# EAGLE design EthernetGCS (EAGLE 6.1)
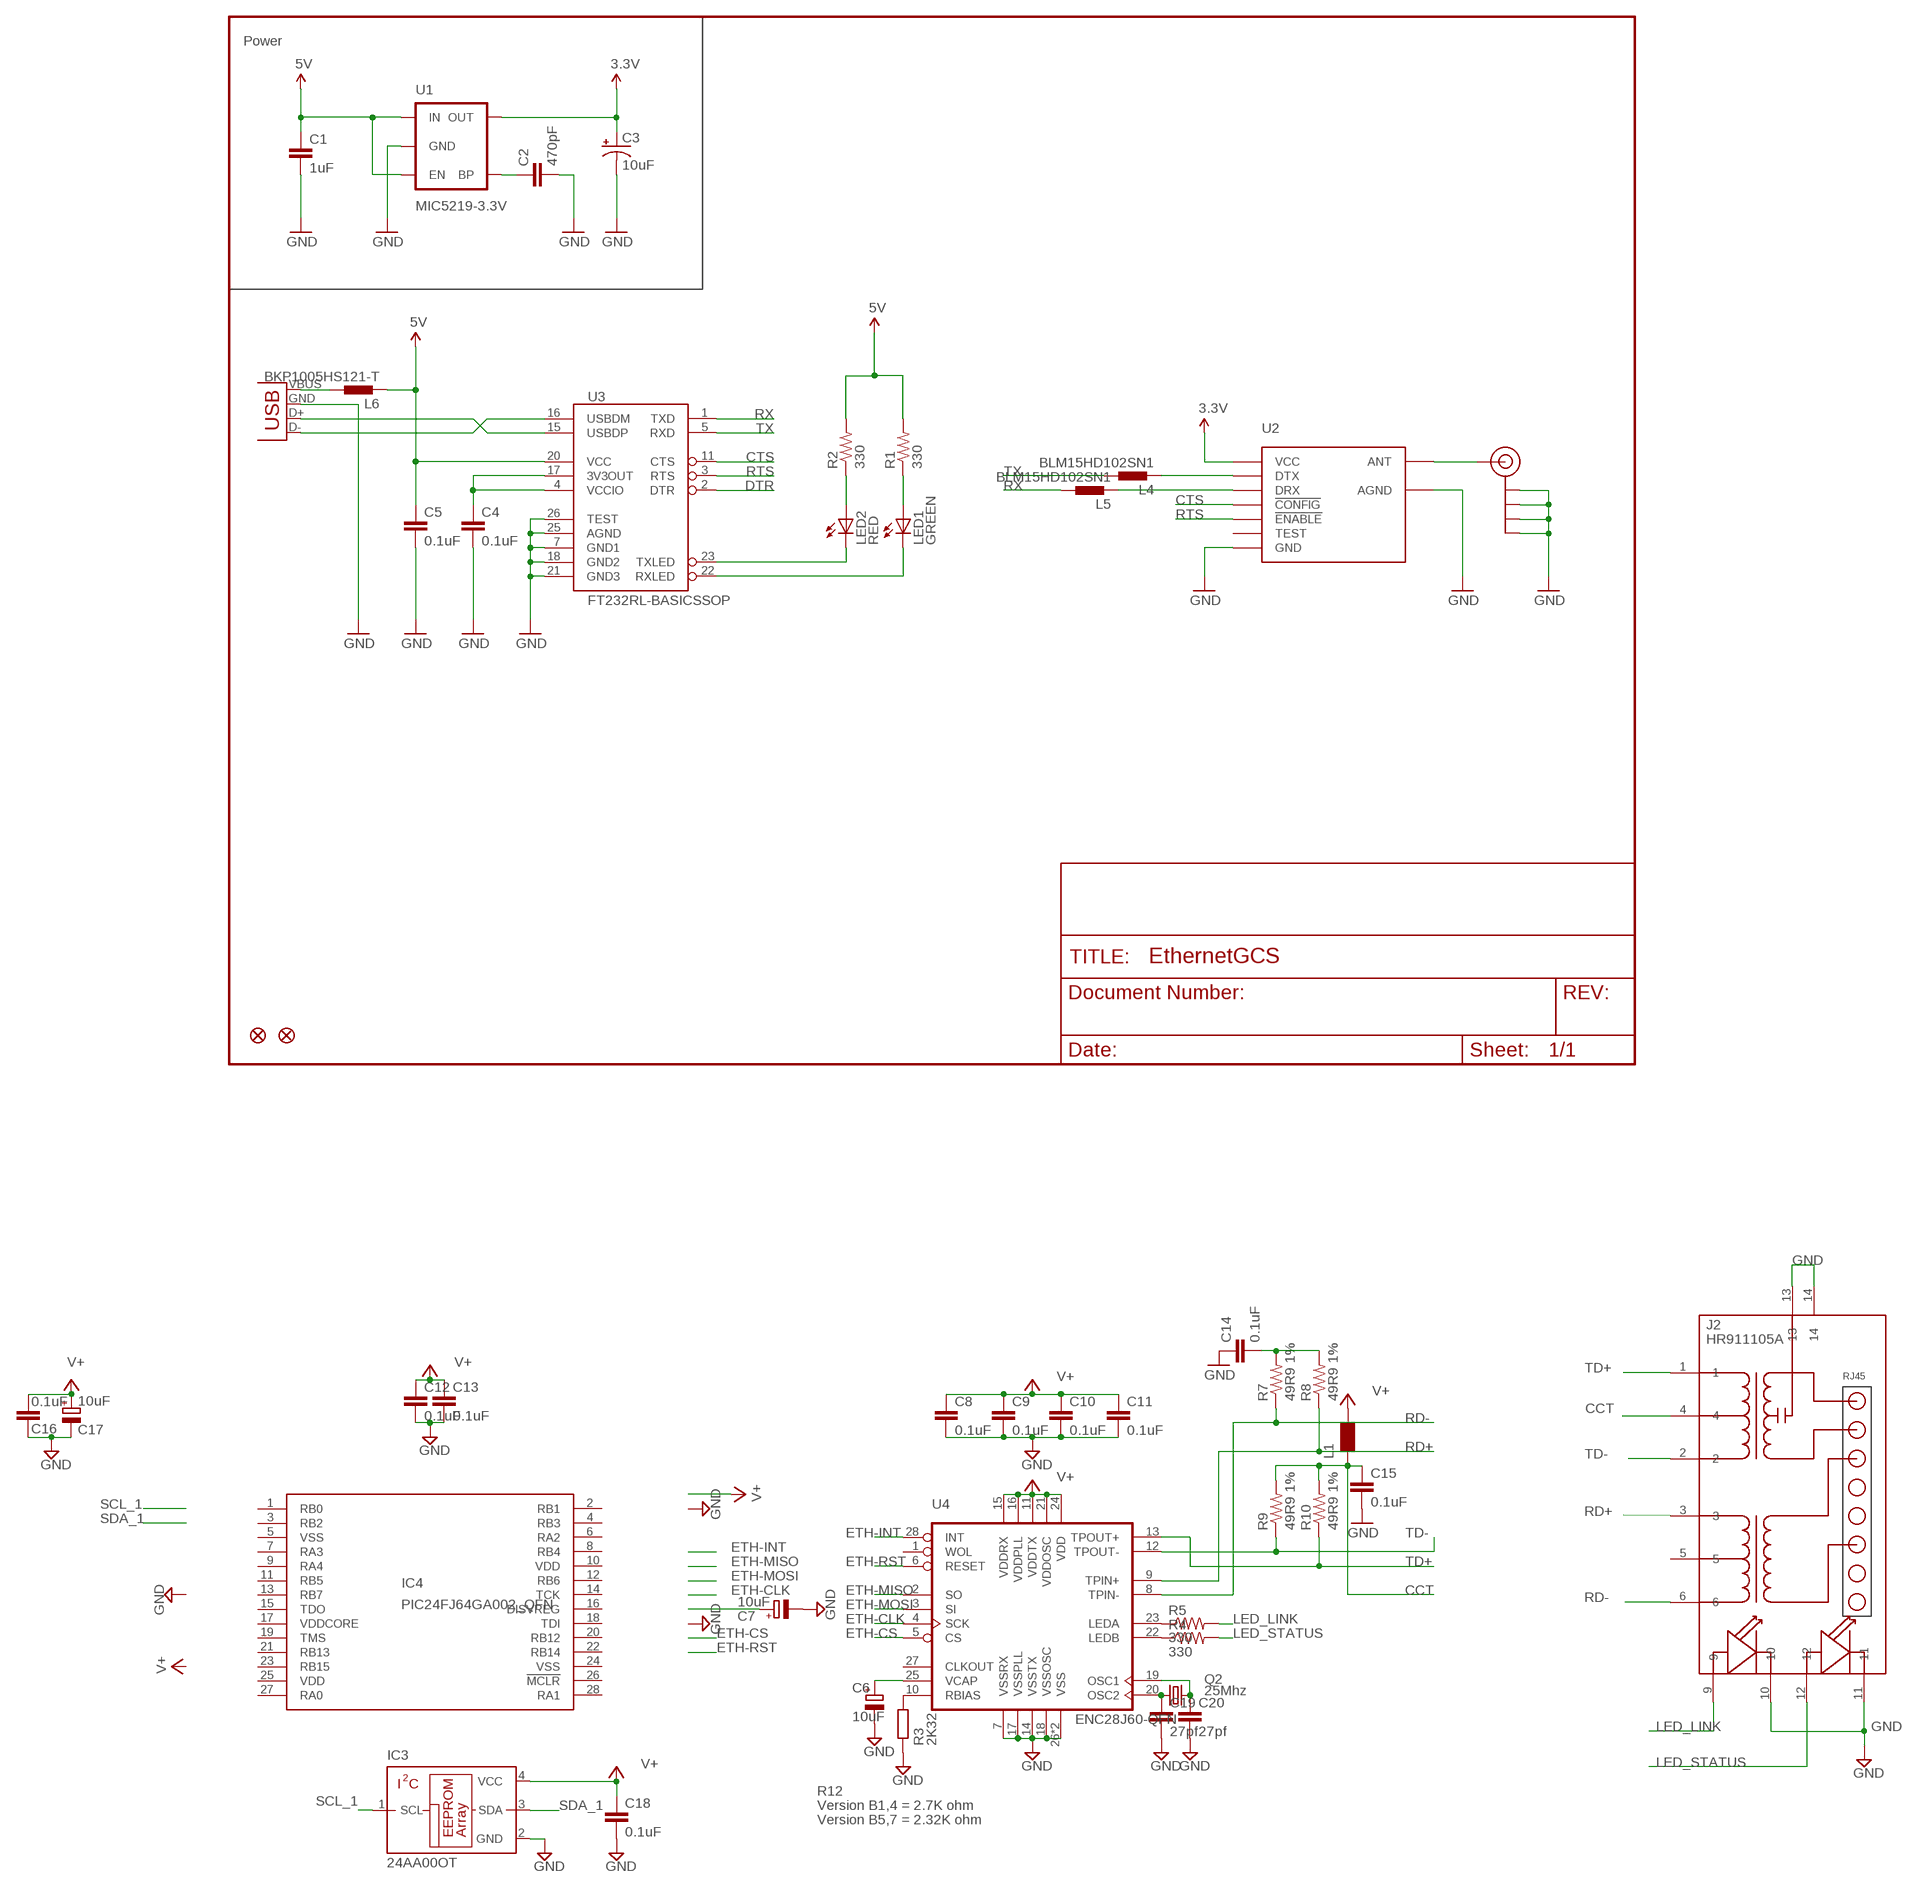
[diagram p0: schematic, sheet 1]

## Parts
C1  1uF  CAP0402-CAP  [0402-CAP]
C2  470pF  CAP0402-CAP  [0402-CAP]
C3  10uF  CAP_POL1206  [EIA3216]
C4  0.1uF  CAP0402-CAP  [0402-CAP]
C5  0.1uF  CAP0402-CAP  [0402-CAP]
C6  10uF  CPOL-EUSMCA  [SMC_A]
C7  10uF  CPOL-EUSMCA  [SMC_A]
C8  0.1uF  CAP0402-CAP  [0402-CAP]
C9  0.1uF  CAP0402-CAP  [0402-CAP]
C10  0.1uF  CAP0402-CAP  [0402-CAP]
C11  0.1uF  CAP0402-CAP  [0402-CAP]
C12  0.1uF  CAP0402-CAP  [0402-CAP]
C13  0.1uF  CAP0402-CAP  [0402-CAP]
C14  0.1uF  CAP0402-CAP  [0402-CAP]
C15  0.1uF  CAP0402-CAP  [0402-CAP]
C16  0.1uF  C-EUC0805  [C0805]
C17  10uF  CPOL-EUSMCA  [SMC_A]
C18  0.1uF  CAP0402-CAP  [0402-CAP]
C19  27pf  CAP0402-CAP  [0402-CAP]
C20  27pf  CAP0402-CAP  [0402-CAP]
IC3  24AA00OT  [SOT23-5L]
IC4  PIC24FJ64GA002_QFN  [QFN28-ML_6X6MM]
J2  HR911105A  [HR911105A]
J$1  SMA_EDGE  [SMA-EDGE]
JP1  FIDUCIAL1X2  [FIDUCIAL-1X2]
JP2  FIDUCIAL1X2  [FIDUCIAL-1X2]
L1  WE-KIL_0805  [WE-KI_0805_B]
L4  BLM15HD102SN1  INDUCTOR-0402  [0402-IND]
L5  BLM15HD102SN1  INDUCTOR-0402  [0402-IND]
L6  BKP1005HS121-T  INDUCTOR-0402  [0402-IND]
LED1  GREEN  LED0603  [LED-0603]
LED2  RED  LED0603  [LED-0603]
Q2  25Mhz  CRYSTALCTS406  [CTS406]
R1  330  RESISTOR0402-RES  [0402-RES]
R2  330  RESISTOR0402-RES  [0402-RES]
R3  2K32  R-EU_R0805  [R0805]
R4  330  RESISTOR0402-RES  [0402-RES]
R5  330  RESISTOR0402-RES  [0402-RES]
R7  49R9 1%  RESISTOR0402-RES  [0402-RES]
R8  49R9 1%  RESISTOR0402-RES  [0402-RES]
R9  49R9 1%  RESISTOR0402-RES  [0402-RES]
R10  49R9 1%  RESISTOR0402-RES  [0402-RES]
U1  MIC5219-3.3V  V_REG_LDOSMD  [SOT23-5]
U2  HM-TRPSMD  [HM-TRP-SMD]
U3  FT232RL-BASICSSOP  [SSOP28DB]
U4  ENC28J60-QFN  [QFN28]
X1  USB-A-H  [USB-A-H]

## Nets
3.3V: C3.A(+) U1.5(OUT) U2.VCC
5V: C1.1 C5.1 L6.P$2 R1.2 R2.2 U1.1(IN) U1.3(EN) U3.20(VCC)
CCT: C15.1 J2.4 L1.2 R9.2 R10.2
CTS: U2.!CONFIG U3.11(CTS)
DTR: U3.2(DTR)
ETH-CLK: U4.4(SCK)
ETH-CS: U4.5(CS)
ETH-INT: U4.28(INT)
ETH-MISO: U4.2(SO)
ETH-MOSI: U4.3(SI)
ETH-RST: U4.6(RESET)
GND: C1.2 C2.2 C3.C(-) C4.2 C5.2 C6.- C7.- C8.2 C9.2 C10.2 C11.2 C12.2 C13.2 C14.1 C15.2 C16.2 C17.- C18.2 C19.2 C20.2 IC3.2(GND) J2.10 J2.11 J2.13 J2.14 J$1.GND@0(GND) J$1.GND@1(GND) J$1.GND@2(GND) J$1.GND@3(GND) R3.1 U1.2(GND) U2.AGND U2.GND U3.7(GND1) U3.18(GND2) U3.21(GND3) U3.25(AGND) U3.26(TEST) U4.7(VSSRX) U4.14(VSSTX) U4.17(VSSPLL) U4.18(VSSOSC) U4.26(VSS) U4.EXP(VSS) X1.GND(VBUS)
LED_LINK: J2.9 R5.2
LED_STATUS: J2.12 R4.2
N$1: J$1.SIG(SIGNAL) U2.ANT
N$2: C2.1 U1.4(BP)
N$3: C4.1 U3.4(VCCIO) U3.17(3V3OUT)
N$4: L4.P$2 U2.DTX
N$5: U3.15(USBDP) X1.D+(D-)
N$6: U3.16(USBDM) X1.D-(D+)
N$7: L5.P$2 U2.DRX
N$8: LED2.A R2.1
N$9: LED1.A R1.1
N$10: LED2.C U3.23(TXLED)
N$11: LED1.C U3.22(RXLED)
N$12: L6.P$1 X1.VBUS(GND)
N$13: C6.+ U4.25(VCAP)
N$14: C19.1 Q2.1 U4.20(OSC2)
N$15: C20.1 Q2.3 U4.19(OSC1)
N$16: C7.+
N$17: R3.2 U4.10(RBIAS)
N$18: R5.1 U4.23(LEDA)
N$19: R4.1 U4.22(LEDB)
N$22: C14.2 R7.2 R8.2
RD+: J2.3 R8.1 U4.9(TPIN+)
RD-: J2.6 R7.1 U4.8(TPIN-)
RTS: U2.!ENABLE U3.3(RTS)
RX: L5.P$1 U3.1(TXD)
SCL_1: IC3.1(SCL)
SDA_1: IC3.3(SDA)
TD+: J2.1 R10.1 U4.13(TPOUT+)
TD-: J2.2 R9.1 U4.12(TPOUT-)
TX: L4.P$1 U3.5(RXD)
V+: C8.1 C9.1 C10.1 C11.1 C12.1 C13.1 C16.1 C17.+ C18.1 IC3.4(VCC) L1.1 U4.11(VDDTX) U4.15(VDDRX) U4.16(VDDPLL) U4.21(VDDOSC) U4.24(VDD)
Unconnected: IC4.1(RB0) IC4.2(RB1) IC4.3(RB2) IC4.4(RB3) IC4.6(RA2) IC4.7(RA3) IC4.8(RB4) IC4.9(RA4) IC4.11(RB5) IC4.12(RB6) IC4.13(RB7) IC4.14(TCK) IC4.15(TDO) IC4.16(DISVREG) IC4.18(TDI) IC4.19(TMS) IC4.20(RB12) IC4.21(RB13) IC4.22(RB14) IC4.23(RB15) IC4.26(!MCLR) IC4.27(RA0) IC4.28(RA1) J2.5 U2.TEST U4.1(WOL) U4.27(CLKOUT)

## Notes on the sheet
- Power
- R12
- Version B1,4 = 2.7K ohm
- Version B5,7 = 2.32K ohm

## Power pins joined to a net without a drawn wire
VDD: IC4.10(VDD) IC4.25(VDD)
VDDCORE: IC4.17(VDDCORE)
VSS: IC4.5(VSS) IC4.24(VSS)

## Library data of the parts
C1 C2 C4 C5 C8-C15 C18-C20 = SparkFun:CAP: Capacitor Standard 0603 ceramic capacitor, and 0.1" leaded capacitor.
C3 = SparkFun:CAP_POL: Capacitor Polarized These are standard SMD and PTH capacitors. Normally 10uF, 47uF, and 100uF in electrolytic and tantalum varieties. Always verify the external diameter of the through hole cap, it varies with capacity, voltage, and manufacturer. The EIA devices should be standard.
C6 C7 C17 = rcl:CPOL-EU: POLARIZED CAPACITOR, European symbol
C16 = rcl:C-EU: CAPACITOR, European symbol
IC3 = microchip:24*00: Serial EEPROM 128 bit, I2C (AA = 1.8 V/LC = 2.5 V/C = 5.0 V); MF: MICROCHIP; MPN: 24AA00T-I/OTG; OC_FARNELL: 1331264; OC_NEWARK: 89H3038
IC4 = microchip:PIC24FJ64GA002_QFN: PIC24FJ64GA002_QFN edit this description Auto generated by make-symbol-device-package-bsdl.ulp Rev. 25 Source: PIC24FJ64GA002_QFN.bsd; MPN: PIC24FJ64GA002-E/ML; OC_FARNELL: 1818728; OC_NEWARK: 98M1922
J2 = CONNECTER:HR911105A
J$1 = 3DRobotics:SMA_EDGE: SMA Antenna Connector End launch SMA connector. The paste layer has been removed so that the connector can be hand soldered onto the board after reflow.
JP1 JP2 = SparkFun:FIDUCIAL: Fiducial Alignment Points Various fiducial points for machine vision alignment.
L1 = wuerth-elektronik:WE-KIL: SMD Wire Wound Ceramic Inductor WE-KIL - Low profile - High Q values -- Bluetooth -- Wireless LAN -- RF oscillation circuit -- IF impedance matching
L4-L6 = pel_dipol_comp:INDUCTOR
LED1 LED2 = SparkFun:LED: LEDs Standard schematic elements and footprints for 5mm, 3mm, 1206, and 0603 sized LEDs. 5mm - Spark Fun Electronics SKU : COM-00529 (and others)
Q2 = crystal:CRYSTAL: CRYSTAL
R1 R2 R4 R5 R7-R10 = SparkFun:RESISTOR: Resistor Basic schematic elements and footprints for 0603, 1206, and PTH resistors.
R3 = rcl:R-EU_: RESISTOR, European symbol
U1 = SparkFun:V_REG_LDO: Voltage Regulator LDO Standard 150mA LDO voltage regulator in SOT-23 layout. Micrel part MIC5205. BP (by-pass) pin is used to lower output noise with 470pF cap.
U2 = 3DRobotics:HM-TRP: HM-TRP Series 100mW Transceiver module HM-TRP series is a low cost, high performance transparent FSK transceiver with operating at 433/470/868/915 MHz. It features small size, high output power, high sensitivity, long transmission distance and high communication data rate with auto set up for communication change and data receiving and transmission control. There is UART interface, it is easy to realize the wireless data transmission with only providing the UART data. It is flexible for the users to set the UART baud rate, frequency, output power, data rate, frequency deviation, receiving bandwidth etc parameters. It is your ideal choice for designing wireless data transmission products which can be widely used on wireless data transmission field.
U3 = SparkFun:FT232RL-BASIC: USB UART This is the simplified version of the FT232RL unit. Only what you need, nothing you don't. Spark Fun Electronics SKU : COM-00650
U4 = microchip-enc28j60:ENC28J60-*: Microchip 10Mbit Eth. contoller with SPI interface
X1 = SparkFun:USB: USB Connectors USB-B-PTH is fully proven SKU : PRT-00139 USB-miniB is fully proven SKU : PRT-00587 USB-A-PCB is untested. USB-A-H is throughly reviewed, but untested. Spark Fun Electronics SKU : PRT-00437 USB-B-SMT is throughly reviewed, but untested. Needs silkscreen touching up. USB-A-S has not been used/tested USB-MB-H has not been used/tested

## Board
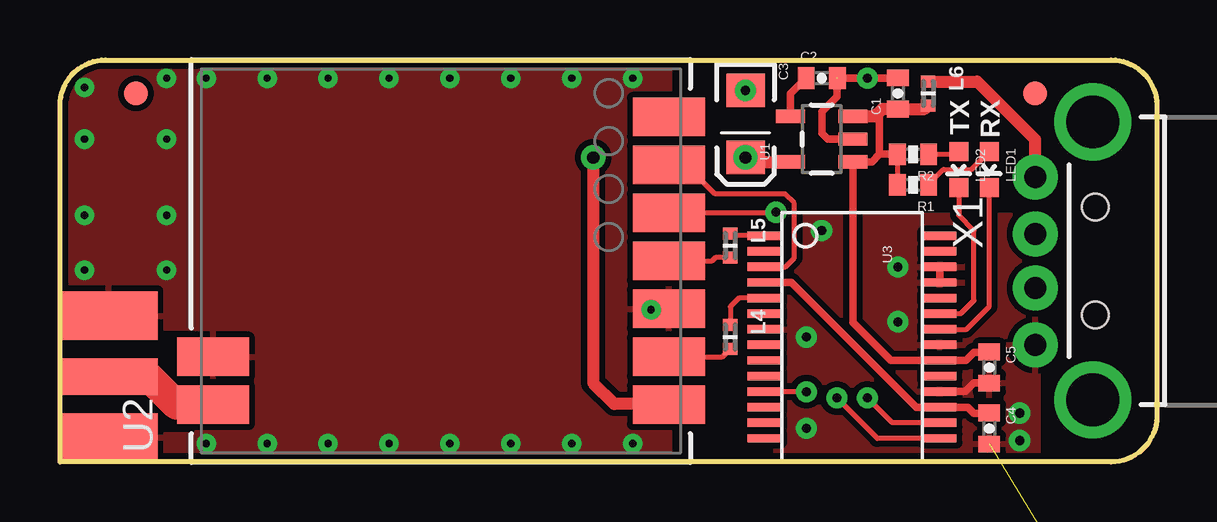
[diagram p1: board, top side]
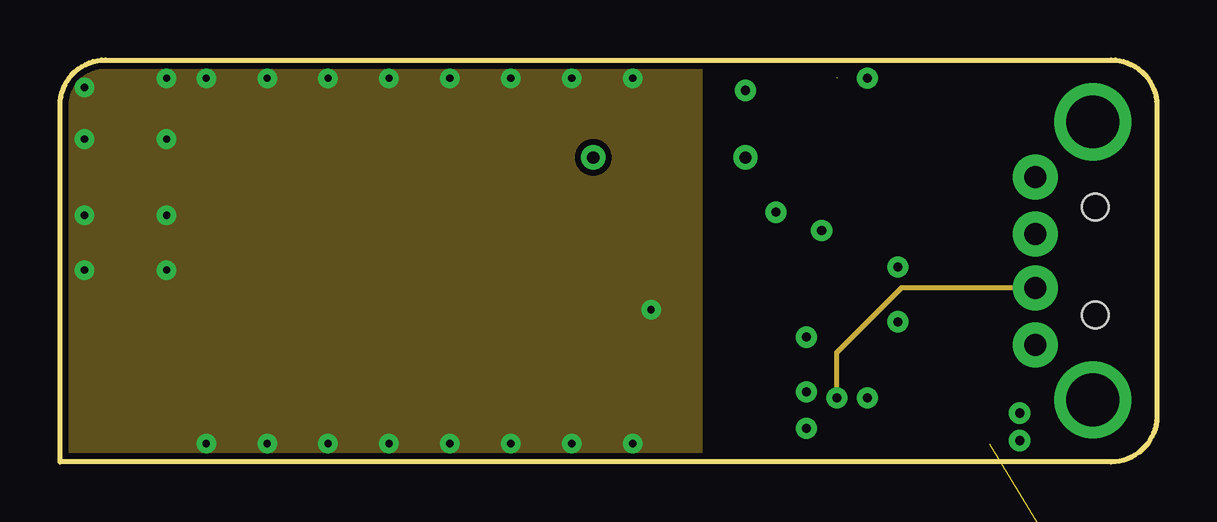
[diagram p2: board, inner layer Route2]
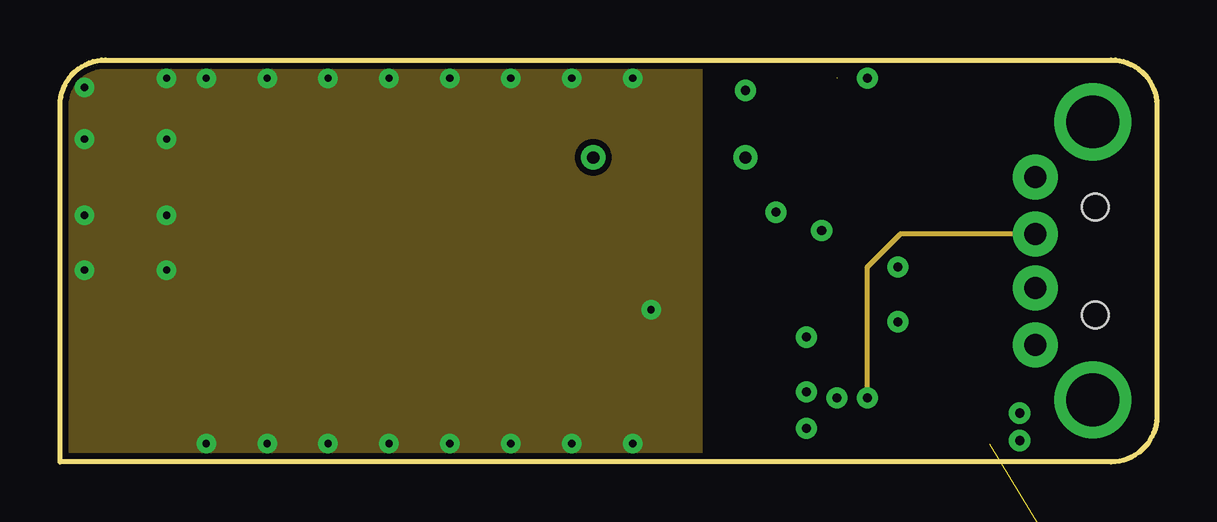
[diagram p3: board, inner layer Route15]
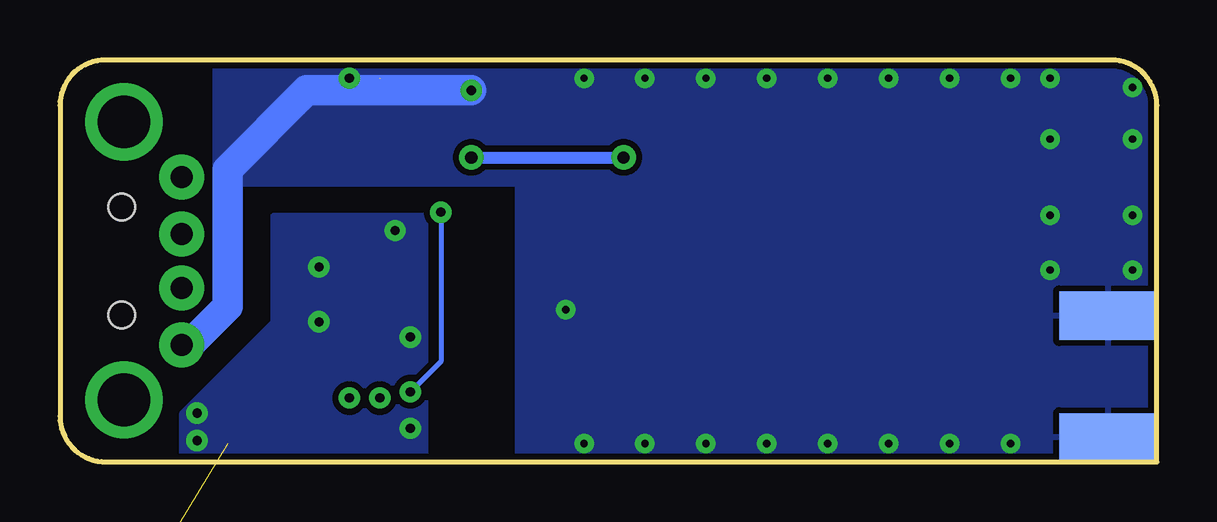
[diagram p4: board, bottom side, seen from below]

Size 45.72 x 16.76 mm. Coordinates in mm from the lower left corner, seen from the top.
Outline: 0,0 0,14.86 arc-90 1.91,16.76 43.81,16.76 arc-90 45.72,14.86 45.72,1.9 arc-90 43.81,0 0,0
Copper layers (1*2*15*16): Top 0.035mm / dielectric 0.5mm / Route2 0.035mm / dielectric 0.5mm / Route15 0.035mm / dielectric 0.5mm / Bottom 0.035mm
Design rules: minimum track width 7mil, minimum drill 10mil, track to track 7mil, track to pad 7mil, pad to pad 7mil, via to via 7mil, smd to smd 0mil, copper to edge 10mil, drill to drill 8mil, minimum pad ring 12mil, minimum via ring 10mil, stop-mask expansion 4mil, vias tented up to drill 25mil, thermal gap 10mil

### Footprints (pad centres in the part's own frame; a part is rotated, then mirrored left to right if it is on the bottom)
0402-CAP = smd 0.7 x 0.9: 1 -0.65,0; 2 0.65,0
EIA3216 = smd 1.4 x 1.6: A 1.4,0; C -1.4,0
SMC_A = smd 1.6 x 1.4: + -1.5,0; - 1.5,0
C0805 = smd 1.3 x 1.5: 1 -0.95,0; 2 0.95,0
SOT23-5L = smd 0.55 x 1.2: 1 -0.95,-1.3; 2 0,-1.3; 3 0.95,-1.3; 4 0.95,1.3; 5 -0.95,1.3
QFN28-ML_6X6MM = smd 0.7 x 0.35: 1 -2.7,1.95; 2 -2.7,1.3; 3 -2.7,0.65; 4 -2.7,0; 5 -2.7,-0.65; 6 -2.7,-1.3; 7 -2.7,-1.95; 15 2.7,-1.95; 16 2.7,-1.3; 17 2.7,-0.65; 18 2.7,0; 19 2.7,0.65; 20 2.7,1.3; 21 2.7,1.95 | smd 0.35 x 0.7: 8 -1.95,-2.7; 9 -1.3,-2.7; 10 -0.65,-2.7; 11 0,-2.7; 12 0.65,-2.7; 13 1.3,-2.7; 14 1.95,-2.7; 22 1.95,2.7; 23 1.3,2.7; 24 0.65,2.7; 25 0,2.7; 26 -0.65,2.7; 27 -1.3,2.7; 28 -1.95,2.7 | smd 3.7 x 3.7: EXP 0,0
HR911105A = drill 0.813 pad 1.524 square: 1 4.445,-6.35 | drill 0.813 pad 1.524: 2 3.175,-8.89; 3 1.905,-6.35; 4 0.635,-8.89; 5 -0.635,-6.35; 6 -1.905,-8.89; 7 -3.175,-6.35; 8 -4.445,-8.89; 9 6.604,4.902; 10 4.064,4.902; 11 -4.064,4.902; 12 -6.604,4.902 | drill 1.651 pad 2.159: 13 8.001,-3.175; 14 -8.001,-3.175 | hole 3.2: 5.715,0; -5.715,0
SMA-EDGE = smd 2.032 x 4.064: GND@0 -2.54,0; GND@1 2.54,0 | smd 2.032 x 4.064 bottom: GND@2 -2.54,0; GND@3 2.54,0 | smd 1.524 x 4.064: SIG 0,0
FIDUCIAL-1X2 = smd 1 x 1: 1 0,0
WE-KI_0805_B = smd 1.02 x 1.78: 1 -0.89,0; 2 0.89,0
0402-IND = smd 0.5 x 0.6: P$1 -0.5,0; P$2 0.5,0
LED-0603 = smd 0.8 x 0.8: A 0,-0.75; C 0,0.75
CTS406 = smd 1.9 x 1.4: 1 -2.2,-1.2; 2 2.2,-1.2; 3 2.2,1.2; 4 -2.2,1.2
0402-RES = smd 0.7 x 0.9: 1 -0.65,0; 2 0.65,0
R0805 = smd 1.3 x 1.5: 1 -0.95,0; 2 0.95,0
SOT23-5 = smd 0.55 x 1.2: 1 -0.95,-1.3; 2 0,-1.3; 3 0.95,-1.3; 4 0.95,1.3; 5 -0.95,1.3
HM-TRP-SMD = smd 1.6 x 3: !CONFIG 2,-9.5; !ENABLE 4,-9.5; AGND -4,9.5; ANT -6,9.5; DRX 0,-9.5; DTX -4,-9.5; GND -2,-9.5; TEST 6,-9.5; VCC -6,-9.5
SSOP28DB = smd 0.348 x 1.397: 1 -4.225,-3.656; 2 -3.575,-3.656; 3 -2.925,-3.656; 4 -2.275,-3.656; 5 -1.625,-3.656; 6 -0.975,-3.656; 7 -0.325,-3.656; 8 0.325,-3.656; 9 0.975,-3.656; 10 1.625,-3.656; 11 2.275,-3.656; 12 2.925,-3.656; 13 3.575,-3.656; 14 4.225,-3.656; 15 4.225,3.656; 16 3.575,3.656; 17 2.925,3.656; 18 2.275,3.656; 19 1.625,3.656; 20 0.975,3.656; 21 0.325,3.656; 22 -0.325,3.656; 23 -0.975,3.656; 24 -1.625,3.656; 25 -2.275,3.656; 26 -2.925,3.656; 27 -3.575,3.656; 28 -4.225,3.656
QFN28 = smd 0.7 x 0.35: 1 -2.7,1.95; 2 -2.7,1.3; 3 -2.7,0.65; 4 -2.7,0; 5 -2.7,-0.65; 6 -2.7,-1.3; 7 -2.7,-1.95; 15 2.7,-1.95; 16 2.7,-1.3; 17 2.7,-0.65; 18 2.7,0; 19 2.7,0.65; 20 2.7,1.3; 21 2.7,1.95 | smd 0.35 x 0.7: 8 -1.95,-2.7; 9 -1.3,-2.7; 10 -0.65,-2.7; 11 0,-2.7; 12 0.65,-2.7; 13 1.3,-2.7; 14 1.95,-2.7; 22 1.95,2.7; 23 1.3,2.7; 24 0.65,2.7; 25 0,2.7; 26 -0.65,2.7; 27 -1.3,2.7; 28 -1.95,2.7 | smd 3.7 x 3.7: EXP 0,0
USB-A-H = drill 0.914 pad 1.88: D+ 2.4,1.127; D- 2.4,-1.127; GND 2.4,3.5; VBUS 2.4,-3.5 | drill 2.2: GND2 0,-5.8; GND3 0,5.8 | hole 1.1: -0.1,2.25; -0.1,-2.25

### Placement (x,y rotation side)
C1  34.92,15.37 90 top
C2  31.75,16 0 top
C3  28.57,14.1 270 top
C4  38.73,1.4 270 top
C5  38.73,3.94 270 top
C6  12.7,-58.29 0 top  (outside the outline)
C7  17.78,-58.29 0 top  (outside the outline)
C8  0.64,-63.37 0 top  (outside the outline)
C9  0.64,-66.55 0 top  (outside the outline)
C10  0.64,-69.72 0 top  (outside the outline)
C11  0.64,-72.9 0 top  (outside the outline)
C12  0.64,-82.42 0 top  (outside the outline)
C13  0.64,-85.6 0 top  (outside the outline)
C14  0.64,-76.07 0 top  (outside the outline)
C15  0.64,-79.25 0 top  (outside the outline)
C16  28.57,-52.58 0 top  (outside the outline)
C17  22.86,-58.29 0 top  (outside the outline)
C18  0.64,-88.77 0 top  (outside the outline)
C19  0.64,-114.17 0 top  (outside the outline)
C20  0.64,-117.35 0 top  (outside the outline)
IC3  23.5,-30.35 0 top  (outside the outline)
IC4  49.53,-39.24 0 top  (outside the outline)
J2  77.47,-39.24 270 top  (outside the outline)
J$1  2.03,3.56 90 top
JP1  40.64,15.37 0 top
JP2  3.17,15.37 0 top
L1  27.3,-57.02 0 top  (outside the outline)
L4  27.94,5.21 270 top
L5  27.94,9.02 270 top
L6  36.2,15.37 270 top
LED1  38.73,12.19 180 top
LED2  37.47,12.19 180 top
Q2  17.14,-30.99 0 top  (outside the outline)
R1  35.56,11.56 180 top
R2  35.56,12.83 180 top
R3  33.02,-39.88 0 top  (outside the outline)
R4  0.64,-107.82 0 top  (outside the outline)
R5  0.64,-111 0 top  (outside the outline)
R7  0.64,-95.12 0 top  (outside the outline)
R8  0.64,-98.3 0 top  (outside the outline)
R9  0.64,-101.47 0 top  (outside the outline)
R10  0.64,-104.65 0 top  (outside the outline)
U1  31.75,13.46 90 top
U2  15.88,8.38 90 top
U3  33.02,5.21 270 top
U4  59.69,-35.43 0 top  (outside the outline)
X1  43.05,8.38 180 top

### Tracks (layer width: path | path; a pad name or v marks a point on that pad's centre or on a via)
3.3V  (via drill 0.51)
  Top 0.508: U2.VCC 25.41,2.41 23.11,2.41 22.23,3.3 v22.23,12.7 | U1.5 29.39,12.51 C3.A
  Bottom 0.508: C3.A v22.23,12.7
  other vias: 28.57,12.7
5V
  Top 0.203: R2.2 R1.2
  Top 0.305: C5.1 38.72,4.57 38.1,4.57 37.76,4.23 U3.20 34.63,4.23 33.05,5.81 U1.1 33.85,12.51 34.16,12.83 | 34.16,12.83 34.16,14.73 34.91,14.73 C1.1 | R2.2 34.16,12.83
  Top 0.508: U1.3 33.97,14.41 34.27,14.72 C1.1 36.05,14.72 L6.P$2
CCT  (4 unrouted)
CTS  (via drill 0.38)
  Top 0.203: U2.!CONFIG 29.81,10.38 v29.84,10.41 | U3.11 v31.1,2.93 v31.11,2.92
  Bottom 0.203: v29.84,10.41 29.84,4.19 v31.11,2.92
GND  (via drill 0.3, 0.38)  (28 unrouted)
  Top 0.305: U3.18 37.73,2.93 38.1,3.3 C5.2 | U3.25 U3.26 | U1.2 32,13.46 31.75,13.72 31.75,14.61 32.38,15.24 32.38,16 v33.66,16 C1.2 | C3.C
  Bottom 0.305: v33.66,16 34.04,16 34.29,15.75
  Bottom 1.27: C3.C 35.43,15.49 38.73,12.19 38.73,6.48 40.33,4.88 X1.GND
  other vias: 1.02,15.62 4.45,16 6.1,16 8.64,16 11.18,16 13.72,16 16.26,16 18.8,16 21.34,16 1.02,10.29 1.02,13.46 1.02,8 4.45,8 4.45,10.29 4.45,13.46 6.1,0.76 8.64,0.76 11.18,0.76 13.72,0.76 16.26,0.76 18.8,0.76 21.34,0.76 24.64,6.35 23.88,16 23.88,0.76 34.92,8.13 31.11,5.21 34.92,5.84 31.75,9.65 31.11,1.4 40.01,2.03 40.01,0.89 28.57,15.49
  pour Top (isolate 0.254): 5.71,-1.14 5.71,19.18 25.4,19.18 25.4,-1.14
  pour Bottom (isolate 0.254): 5.71,-1.14 5.71,20.45 26.67,20.45 26.67,-1.14
  pour Top (isolate 0.254): 5.71,-1.14 -0.64,-1.14 -0.64,1.14 5.71,1.14
  pour Top (isolate 0.254): -0.64,5.59 5.71,5.59 5.71,17.91 -0.64,17.91
  pour Bottom (isolate 0.254): 5.71,17.91 -1.27,17.91 -1.27,4.83 5.84,4.83
  pour Bottom (isolate 0.254): -1.27,-1.14 -1.27,5.46 5.71,5.46 5.71,-1.14
  pour Route2 (isolate 0.254): 0,-0.51 0,21.08 26.67,20.45 26.67,-1.14
  pour Route15 (isolate 0.254): 0,-0.51 0,22.35 26.67,22.35 26.67,-0.51
  pour Top (isolate 0.254): 29.84,-1.78 29.84,10.29 40.77,10.29 40.77,-1.78
  pour Bottom (isolate 0.254): 40.64,-2.41 40.64,2.03 36.83,5.84 36.83,10.29 30.48,10.29 30.48,-2.41
  pour Bottom (isolate 0.254): 26.67,19.18 26.67,11.56 39.24,11.56 39.24,19.18
LED_LINK  (1 unrouted)
LED_STATUS  (1 unrouted)
N$1
  Top 1.219: J$1.SIG 3.68,3.56 4.86,2.38 U2.ANT
N$2
  Top 0.305: U1.4 30.45,15.35 C2.1
N$3
  Top 0.305: U3.4 30.49,7.48 35.69,2.28 U3.17 37.85,2.28 38.1,2.03 38.72,2.03 C4.1
N$4
  Top 0.203: U2.DTX 27.61,4.38 L4.P$2
N$5  (via drill 0.38)
  Top 0.203: U3.15 34.07,0.98 v32.38,2.67
  Route2 0.203: v32.38,2.67 32.38,4.57 35.07,7.25 X1.D+
N$6  (via drill 0.38)
  Top 0.203: U3.16 34.69,1.63 v33.66,2.67
  Route15 0.203: v33.66,2.67 33.66,8.13 35.04,9.51 X1.D-
N$7
  Top 0.203: U2.DRX 27.18,8.38 27.31,8.52 L5.P$2
N$8
  Top 0.203: R2.1 37.35,12.83 LED2.A
N$9
  Top 0.203: R1.1 36.21,11.57 36.83,12.19 37.98,12.19 LED1.A
N$10
  Top 0.203: U3.23 37.55,6.18 38.1,6.73 38.1,9.65 37.47,10.29 LED2.C
N$11
  Top 0.203: U3.22 37.79,5.53 38.73,6.48 LED1.C
N$12
  Top 0.508: X1.VBUS 40.65,13.45 38.23,15.87 L6.P$1
N$13  (1 unrouted)
N$14  (2 unrouted)
N$15  (2 unrouted)
N$17  (1 unrouted)
N$18  (1 unrouted)
N$19  (1 unrouted)
N$22  (2 unrouted)
RD+  (2 unrouted)
RD-  (2 unrouted)
RTS
  Top 0.203: U2.!ENABLE 26.1,12.38 27.3,11.18 30.23,11.18 30.61,10.8 30.61,8.51 30.23,8.13 U3.3
RX
  Top 0.203: U3.1 28.02,9.43 L5.P$1
TD+  (2 unrouted)
TD-  (2 unrouted)
TX
  Top 0.203: U3.5 28.3,6.83 27.94,6.48 L4.P$1
V+  (15 unrouted)
VDD  (1 unrouted)
VSS  (1 unrouted)

### Text on the board
tPlace: TX | RX